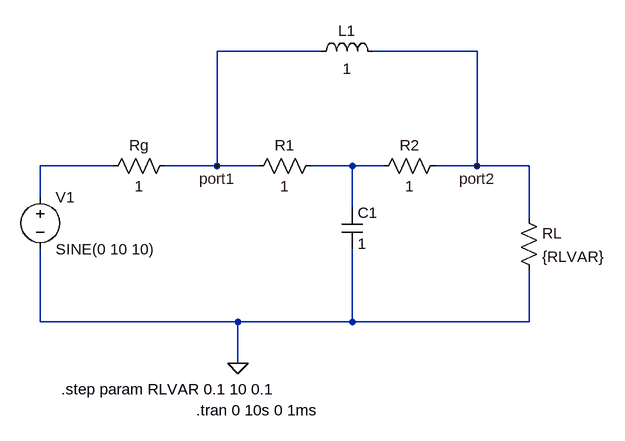
[diagram p0: schematic Part2_2.asc]
Part2_2.asc, the LTspice schematic file:
Version 4
SHEET 1 920 680
WIRE 464 -96 304 -96
WIRE 704 -96 544 -96
WIRE 144 80 32 80
WIRE 304 80 304 -96
WIRE 304 80 224 80
WIRE 368 80 304 80
WIRE 512 80 448 80
WIRE 560 80 512 80
WIRE 704 80 704 -96
WIRE 704 80 640 80
WIRE 784 80 704 80
WIRE 32 128 32 80
WIRE 512 144 512 80
WIRE 784 160 784 80
WIRE 32 320 32 208
WIRE 336 320 32 320
WIRE 512 320 512 208
WIRE 512 320 336 320
WIRE 784 320 784 240
WIRE 784 320 512 320
WIRE 336 384 336 320
FLAG 336 384 0
FLAG 304 80 port1
FLAG 704 80 port2
SYMBOL voltage 32 112 R0
WINDOW 123 0 0 Left 2
WINDOW 39 0 0 Left 2
SYMATTR InstName V1
SYMATTR Value SINE(0 10 10)
SYMBOL res 240 64 R90
WINDOW 0 0 56 VBottom 2
WINDOW 3 32 56 VTop 2
SYMATTR InstName Rg
SYMATTR Value 1
SYMBOL res 464 64 R90
WINDOW 0 0 56 VBottom 2
WINDOW 3 32 56 VTop 2
SYMATTR InstName R1
SYMATTR Value 1
SYMBOL res 656 64 R90
WINDOW 0 0 56 VBottom 2
WINDOW 3 32 56 VTop 2
SYMATTR InstName R2
SYMATTR Value 1
SYMBOL cap 496 144 R0
SYMATTR InstName C1
SYMATTR Value 1
SYMBOL ind 448 -80 R270
WINDOW 0 32 56 VTop 2
WINDOW 3 5 56 VBottom 2
SYMATTR InstName L1
SYMATTR Value 1
SYMBOL res 768 144 R0
SYMATTR InstName RL
SYMATTR Value {RLVAR}
TEXT 272 456 Left 2 !.tran 0 10s 0 1ms
TEXT 64 424 Left 2 !.step param RLVAR 0.1 10 0.1

The netlist it stands for:
* Part2_2.asc
V1 N001 0 SINE(0 10 10)
Rg port1 N001 1
R1 N002 port1 1
R2 port2 N002 1
C1 N002 0 1
L1 port1 port2 1
RL port2 0 {RLVAR}
.tran 0 10s 0 1ms
.step param RLVAR 0.1 10 0.1
.backanno
.end